# Altium project Donation_Box.PrjPcb
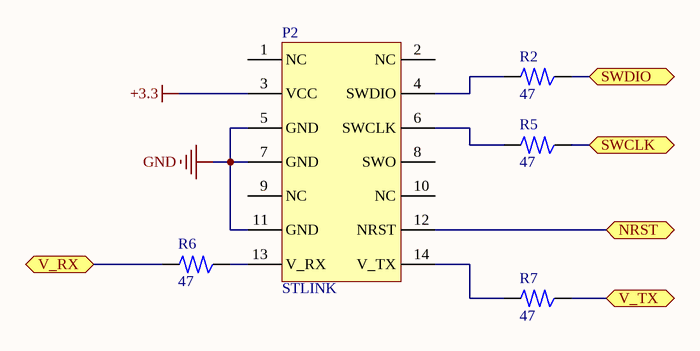
[diagram p0: STlink-plug.SchDoc]
3 sheets, 23 parts. Net scope: flat (ports and power ports of the same name join across sheets).
Board file: DB_PCB.PcbDoc
Sheets:
  STlink-plug.SchDoc
  Out1.SchDoc
  Out2.SchDoc

## Sheet STlink-plug.SchDoc
size A; SheetNumber: 3; SheetTotal: 7

### Parts
P2  STLINK  [SMT_CON_SAMTEC_FTSH-107-01-L-DV-K]
R2  47  [SMT_RES_0805(2012)]
R5  47  [SMT_RES_0805(2012)]
R6  47  [SMT_RES_0805(2012)]
R7  47  [SMT_RES_0805(2012)]

### Ports
NRST (bidir), SWCLK (bidir), SWDIO (bidir), V_RX (bidir), V_TX (bidir)

### Nets
+3.3: P2.3(VCC)
GND: P2.5(GND) P2.7(GND) P2.11(GND)
NetP2_4: P2.4(SWDIO) R2.1
NetP2_6: P2.6(SWCLK) R5.1
NetP2_12: P2.12(NRST) ; port NRST
NetP2_13: P2.13(V_RX) R6.2
NetP2_14: P2.14(V_TX) R7.1
NetR2_2: R2.2 ; port SWDIO
NetR5_2: R5.2 ; port SWCLK
NetR6_1: R6.1 ; port V_RX
NetR7_2: R7.2 ; port V_TX

Not connected (* = marked no-connect by the designer): P2 1(NC) 2(NC) 8(SWO) 9(NC) 10(NC)

### Library data of the parts
P2 = SMT_CON_SAMTEC_FTSH-107-01-L-DV-K: Connector 14-pin Samtec FTSH-107-01-L-DV-K 1.27mm Pitch SMT
R2 R5-R7 = SMT_RES_0805(2012): 0805(2012) Resistor 1/4-1/8W 150V 2A

## Sheet Out1.SchDoc
size A; SheetNumber: 4; SheetTotal: 6
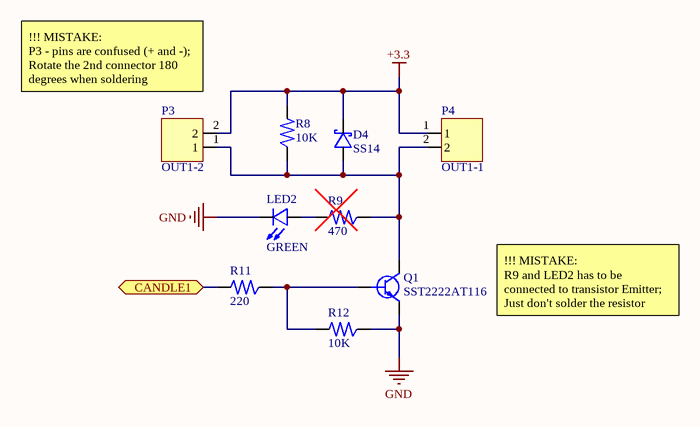
[diagram p1: Out1.SchDoc]

### Parts
D4  SS14  [SMT_DIODE_SCHTKY_VISHAI]
LED2  GREEN  [SMT_LED_0805(2012)_WURTH]
P3  OUT1-2  [THT_CON_WAFER_2P_NEL_2217S-02-WH2]
P4  OUT1-1  [THT_CON_WAFER_2P_NEL_2217S-02-WH2]
Q1  SST2222AT116  [SMT_TRANS_SST2222AT116_SOT23]
R8  10K  [SMT_RES_0805(2012)]
R9  470  [SMT_RES_0805(2012)]
R11  220  [SMT_RES_0805(2012)]
R12  10K  [SMT_RES_0805(2012)]

### Ports
CANDLE1 (bidir)

### Nets
+3.3: D4.2 P3.2 P4.1 R8.1
GND: LED2.1 Q1.1(E) R12.2
NetD4_1: D4.1 P3.1 P4.2 Q1.3(C) R8.2 R9.2
NetLED2_2: LED2.2 R9.1
NetQ1_2: Q1.2(B) R11.2 R12.1
NetR11_1: R11.1 ; port CANDLE1

### Notes on the sheet
- (near P3) !!! MISTAKE:
  P3 - pins are confused (+ and -);
  Rotate the 2nd connector 180 degrees when soldering
- !!! MISTAKE:
  R9 and LED2 has to be connected to transistor Emitter;
  Just don't solder the resistor

### Library data of the parts
D4 = SMT_DIODE_SCHTKY_VISHAI: SMT Diode Schottky Vishay DO-214AC SS14-M3/5AT IF=1A VR=40 V FV=0.5VG
LED2 = SMT_LED_0805(2012)_WURTH: LED 0805(2012) 20mA 2V 150080YS75000 by Wurth Elektronik
P3 P4 = THT_CON_WAFER_2P_NEL_2217S-02-WH2: Connector Wafer NELTRON 2-Pins Pitch-2.54mm 250V/3A 2217S-02-WH2
Q1 = SMT_TRANS_SST2222AT116_SOT23: Transistor NPN SST2222AT116 SOT23 700mA 40V
R8 R9 R11 R12 = SMT_RES_0805(2012): 0805(2012) Resistor 1/4-1/8W 150V 2A

## Sheet Out2.SchDoc
size A; SheetNumber: 5; SheetTotal: 6
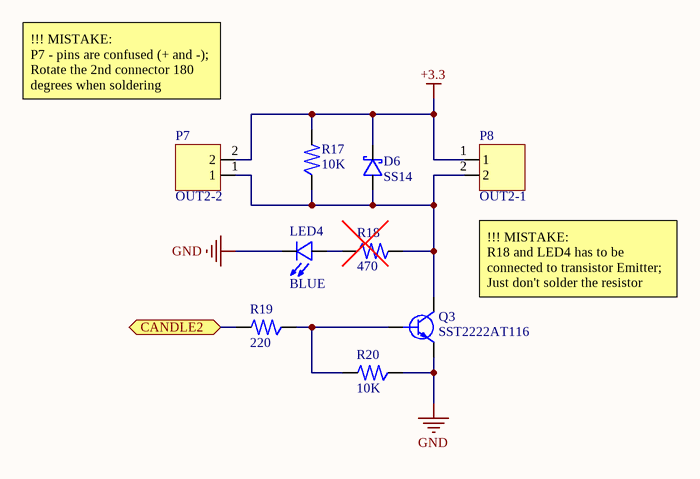
[diagram p2: Out2.SchDoc]

### Parts
D6  SS14  [SMT_DIODE_SCHTKY_VISHAI]
LED4  BLUE  [SMT_LED_0805(2012)_WURTH]
P7  OUT2-2  [THT_CON_WAFER_2P_NEL_2217S-02-WH2]
P8  OUT2-1  [THT_CON_WAFER_2P_NEL_2217S-02-WH2]
Q3  SST2222AT116  [SMT_TRANS_SST2222AT116_SOT23]
R17  10K  [SMT_RES_0805(2012)]
R18  470  [SMT_RES_0805(2012)]
R19  220  [SMT_RES_0805(2012)]
R20  10K  [SMT_RES_0805(2012)]

### Ports
CANDLE2 (bidir)

### Nets
+3.3: D6.2 P7.2 P8.1 R17.1
GND: LED4.1 Q3.1(E) R20.2
NetD6_1: D6.1 P7.1 P8.2 Q3.3(C) R17.2 R18.1
NetLED4_2: LED4.2 R18.2
NetQ3_2: Q3.2(B) R19.2 R20.1
NetR19_1: R19.1 ; port CANDLE2

### Notes on the sheet
- !!! MISTAKE:
  P7 - pins are confused (+ and -);
  Rotate the 2nd connector 180 degrees when soldering
- !!! MISTAKE:
  R18 and LED4 has to be connected to transistor Emitter;
  Just don't solder the resistor

### Library data of the parts
D6 = SMT_DIODE_SCHTKY_VISHAI: as D4 on sheet Out1
LED4 = SMT_LED_0805(2012)_WURTH: as LED2 on sheet Out1
P7 P8 = THT_CON_WAFER_2P_NEL_2217S-02-WH2: as P3 on sheet Out1
Q3 = SMT_TRANS_SST2222AT116_SOT23: as Q1 on sheet Out1
R17-R20 = SMT_RES_0805(2012): 0805(2012) Resistor 1/4-1/8W 150V 2A

## Nets that join several sheets
+3.3: STlink-plug (P2.3), Out1 (D4.2 P3.2 P4.1 R8.1), Out2 (D6.2 P7.2 P8.1 R17.1)
GND: STlink-plug (P2.5 P2.7 P2.11), Out1 (LED2.1 Q1.1 R12.2), Out2 (LED4.1 Q3.1 R20.2)